# Altium schematic sheet Fri3D_2018_CONTROLLER_00.SchDoc: Fri3D Badge 2018
size A3; Date: 22/05/2017; DrawnBy: Wim Van Gool; DocumentNumber: 2; Revision: 00; SheetNumber: 2; SheetTotal: 4
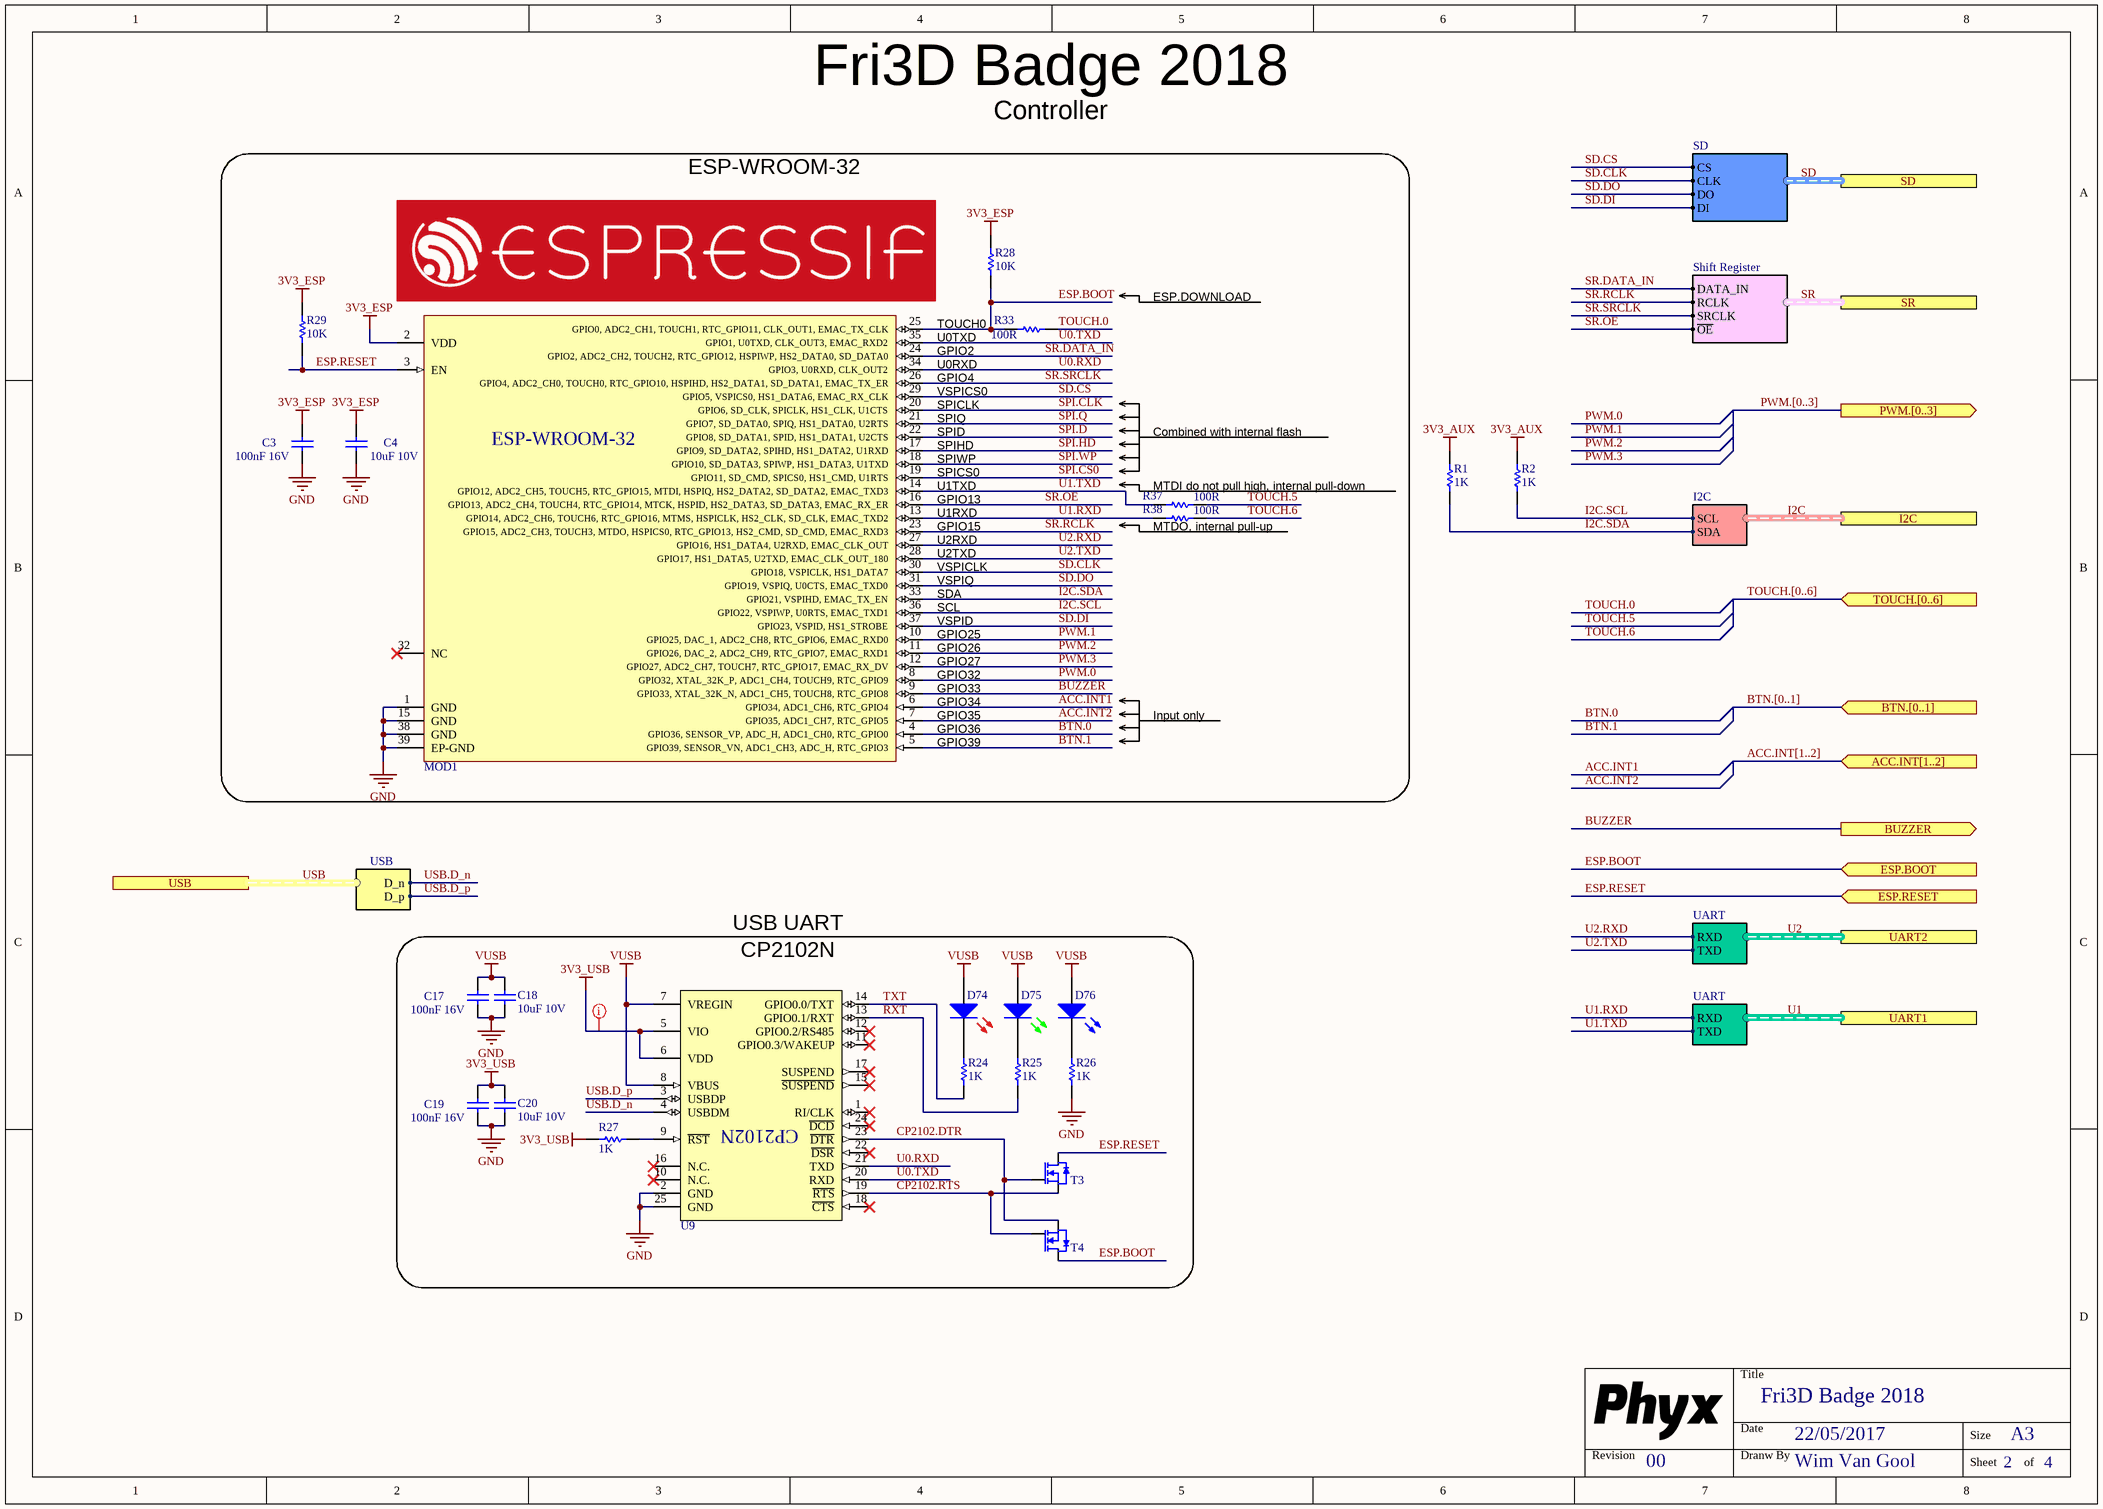
[diagram p0: Fri3D_2018_CONTROLLER_00.SchDoc]

## Parts
C3  value 100nF 16V  [C0603_N]
C4  value 10uF 10V  [C0805_N]  (hidden comment: CAP_CERAMIC)
C17  value 100nF 16V  [C0603_N]
C18  value 10uF 10V  [C0805_N]  (hidden comment: CAP_CERAMIC)
C19  value 100nF 16V  [C0603_N]
C20  value 10uF 10V  [C0805_N]  (hidden comment: CAP_CERAMIC)
D74  Default 0805 Red LED  [LED_0805_RD]  (value not drawn)
D75  Default 0805 Green LED  [LED_0805_GR]  (value not drawn)
D76  Default 0805 Blue LED  [LED_0805_BL]  (value not drawn)
MOD1  ESP-32 based ESP-WROOM-32  [ESP-WROOM-32]  (value not drawn)
R1  value 1K  [R0603_N]
R2  value 1K  [R0603_N]
R24  value 1K  [R0603_N]
R25  value 1K  [R0603_N]
R26  value 1K  [R0603_N]
R27  value 1K  [R0603_N]
R28  value 10K  [R0603_N]  (hidden comment: RESISTOR)
R29  value 10K  [R0603_N]  (hidden comment: RESISTOR)
R33  value 100R  [R0603_N]  (hidden comment: RESISTOR)
R37  value 100R  [R0603_N]  (hidden comment: RESISTOR)
R38  value 100R  [R0603_N]  (hidden comment: RESISTOR)
T3  0.2A N-Ch MOSFET Vgs 3.2  [SOT23-3]  (value not drawn)
T4  0.2A N-Ch MOSFET Vgs 3.2  [SOT23-3]  (value not drawn)
U9  USB to UART 3.3-5V  [QFN_24]  (value not drawn)

## Blocks framed on the sheet
ESP-WROOM-32: C3 C4 MOD1 R28 R29 R33 R37 R38

## Ports
ACC.INT[1..2] (in), BTN.[0..1] (in), BUZZER (out), ESP.BOOT (in), ESP.RESET (in), I2C (harness I2C), PWM.[0..3] (out), SD (harness SD), SR (harness Shift Register), TOUCH.[0..6] (in), UART1 (harness UART), UART2 (harness UART), USB (harness USB)

## Harnesses
Shift Register: DATA_IN, RCLK, SRCLK, ~{OE}
USB: D_p, D_n
I2C: SDA, SCL
SD: CS, CLK, DO, DI
UART: TXD, RXD

## Nets
3V3_AUX: R1.1 R2.1
3V3_ESP: C3.1 C4.1 MOD1.2(VDD) R28.1 R29.1
3V3_USB: C19.1 C20.2 R27.1 U9.5(VIO) U9.6(VDD)
GND: C3.2 C4.2 C17.2 C18.1 C19.2 C20.1 MOD1.1(GND) MOD1.15(GND) MOD1.38(GND) MOD1.39(EP-GND) R26.2 U9.2(GND) U9.25(GND)
VUSB: C17.1 C18.2 D74.1(A) D75.1(A) D76.1(A) U9.7(VREGIN) U9.8(VBUS)
ACC.INT1: MOD1.6(GPIO34,_ADC1_CH6,_RTC_GPIO4)
ACC.INT2: MOD1.7(GPIO35,_ADC1_CH7,_RTC_GPIO5)
BTN.0: MOD1.4(GPIO36,_SENSOR_VP,_ADC_H,_ADC1_CH0,_RTC_GPIO0)
BTN.1: MOD1.5(GPIO39,_SENSOR_VN,_ADC1_CH3,_ADC_H,_RTC_GPIO3)
BUZZER: MOD1.9(GPIO33,_XTAL_32K_N,_ADC1_CH5,_TOUCH8,_RTC_GPIO8) ; port BUZZER
CP2102.DTR: T3.1(G) T4.2(S) U9.23(~{DTR})
CP2102.RTS: T3.2(S) T4.1(G) U9.19(~{RTS})
ESP.BOOT: MOD1.25(GPIO0,_ADC2_CH1,_TOUCH1,_RTC_GPIO11,_CLK_OUT1,_EMAC_TX_CLK) R28.2 R33.1 T4.3(D) ; port ESP.BOOT
ESP.RESET: MOD1.3(EN) R29.2 T3.3(D) ; port ESP.RESET
I2C.SCL: MOD1.36(GPIO22,_VSPIWP,_U0RTS,_EMAC_TXD1) R2.2 ; port I2C.SCL
I2C.SDA: MOD1.33(GPIO21,_VSPIHD,_EMAC_TX_EN) R1.2 ; port I2C.SDA
PWM.0: MOD1.8(GPIO32,_XTAL_32K_P,_ADC1_CH4,_TOUCH9,_RTC_GPIO9)
PWM.1: MOD1.10(GPIO25,_DAC_1,_ADC2_CH8,_RTC_GPIO6,_EMAC_RXD0)
PWM.2: MOD1.11(GPIO26,_DAC_2,_ADC2_CH9,_RTC_GPIO7,_EMAC_RXD1)
PWM.3: MOD1.12(GPIO27,_ADC2_CH7,_TOUCH7,_RTC_GPIO17,_EMAC_RX_DV)
RXT: R25.2 U9.13(GPIO0.1/RXT)
SD.CLK: MOD1.30(GPIO18,_VSPICLK,_HS1_DATA7) ; port SD.CLK
SD.CS: MOD1.29(GPIO5,_VSPICS0,_HS1_DATA6,_EMAC_RX_CLK) ; port SD.CS
SD.DI: MOD1.37(GPIO23,_VSPID,_HS1_STROBE) ; port SD.DI
SD.DO: MOD1.31(GPIO19,_VSPIQ,_U0CTS,_EMAC_TXD0) ; port SD.DO
SPI.CLK: MOD1.20(GPIO6,_SD_CLK,_SPICLK,_HS1_CLK,_U1CTS)
SPI.CS0: MOD1.19(GPIO11,_SD_CMD,_SPICS0,_HS1_CMD,_U1RTS)
SPI.D: MOD1.22(GPIO8,_SD_DATA1,_SPID,_HS1_DATA1,_U2CTS)
SPI.HD: MOD1.17(GPIO9,_SD_DATA2,_SPIHD,_HS1_DATA2,_U1RXD)
SPI.Q: MOD1.21(GPIO7,_SD_DATA0,_SPIQ,_HS1_DATA0,_U2RTS)
SPI.WP: MOD1.18(GPIO10,_SD_DATA3,_SPIWP,_HS1_DATA3,_U1TXD)
SR.DATA_IN: MOD1.24(GPIO2,_ADC2_CH2,_TOUCH2,_RTC_GPIO12,_HSPIWP,_HS2_DATA0,_SD_DATA0) ; port SR.DATA_IN
SR.~{OE}: MOD1.16(GPIO13,_ADC2_CH4,_TOUCH4,_RTC_GPIO14,_MTCK,_HSPID,_HS2_DATA3,_SD_DATA3,_EMAC_RX_ER) ; port SR.~{OE}
SR.RCLK: MOD1.23(GPIO15,_ADC2_CH3,_TOUCH3,_MTDO,_HSPICS0,_RTC_GPIO13,_HS2_CMD,_SD_CMD,_EMAC_RXD3) ; port SR.RCLK
SR.SRCLK: MOD1.26(GPIO4,_ADC2_CH0,_TOUCH0,_RTC_GPIO10,_HSPIHD,_HS2_DATA1,_SD_DATA1,_EMAC_TX_ER) ; port SR.SRCLK
TOUCH.0: R33.2
TOUCH.5: R37.2
TOUCH.6: R38.2
TXT: R24.2 U9.14(GPIO0.0/TXT)
U0.RXD: MOD1.34(GPIO3,_U0RXD,_CLK_OUT2) U9.21(TXD)
U0.TXD: MOD1.35(GPIO1,_U0TXD,_CLK_OUT3,_EMAC_RXD2) U9.20(RXD)
U1.RXD: MOD1.13(GPIO14,_ADC2_CH6,_TOUCH6,_RTC_GPIO16,_MTMS,_HSPICLK,_HS2_CLK,_SD_CLK,_EMAC_TXD2) R38.1 ; port UART1.RXD
U1.TXD: MOD1.14(GPIO12,_ADC2_CH5,_TOUCH5,_RTC_GPIO15,_MTDI,_HSPIQ,_HS2_DATA2,_SD_DATA2,_EMAC_TXD3) R37.1 ; port UART1.TXD
U2.RXD: MOD1.27(GPIO16,_HS1_DATA4,_U2RXD,_EMAC_CLK_OUT) ; port UART2.RXD
U2.TXD: MOD1.28(GPIO17,_HS1_DATA5,_U2TXD,_EMAC_CLK_OUT_180) ; port UART2.TXD
USB.D_n: U9.4(USBDM) ; port USB.D_n
USB.D_p: U9.3(USBDP) ; port USB.D_p
NetD74_2: D74.2(K) R24.1
NetD75_2: D75.2(K) R25.1
NetD76_2: D76.2(K) R26.1
NetR27_2: R27.2 U9.9(~{RST})

Not connected (* = marked no-connect by the designer): MOD1 32(NC)*; U9 1(RI/CLK)* 10(N.C.)* 11(GPIO0.3/WAKEUP)* 12(GPIO0.2/RS485)* 15(~{SUSPEND})* 16(N.C.)* 17(SUSPEND)* 18(~{CTS})* 22(~{DSR})* 24(~{DCD})*

## Buses and harness runs
bus ACC.INT[1..2] = port ACC.INT[1..2]
bus BTN.[0..1] = port BTN.[0..1]
bus PWM.[0..3] = port PWM.[0..3]
bus TOUCH.[0..6] = port TOUCH.[0..6]
harness I2C = port I2C
harness SD = port SD
harness SR = port SR
harness U1 = port UART1
harness U2 = port UART2
harness USB = port USB

## Layout directives
net class POWER: 3V3_USB

## Notes on the sheet
- Fri3D Badge 2018
- Controller
- TOUCH0
- ESP.DOWNLOAD
- (near MOD1) VSPICS0
- U0TXD
- U0RXD
- GPIO2
- (near MOD1) GPIO4
- (near MOD1) SPICLK
- (near MOD1) SPIQ
- (near MOD1) SPID
- (near MOD1) SPIHD
- (near MOD1) SPIWP
- Combined with internal flash
- (near MOD1) SPICS0
- (near MOD1) U1TXD
- (near MOD1) U1RXD
- (near MOD1) GPIO15
- (near MOD1) GPIO13
- (near R37) MTDI do not pull high, internal pull-down
- (near R38) MTDO, internal pull-up
- (near MOD1) SDA
- (near MOD1) VSPICLK
- (near MOD1) VSPIQ
- (near MOD1) U2TXD
- (near MOD1) U2RXD
- (near MOD1) SCL
- (near MOD1) VSPID
- (near MOD1) GPIO25
- (near MOD1) GPIO26
- (near MOD1) GPIO27
- (near MOD1) GPIO32
- (near MOD1) GPIO33
- (near MOD1) GPIO34
- (near MOD1) GPIO35
- (near MOD1) GPIO36
- Input only
- (near MOD1) GPIO39
- USB UART
- (near U9) CP2102N
- Title
- Revision
- Date
- Dranw By
- Size
- A3
- Sheet
- of
- (in symbol CP2102N # QFN24 USB UART) CP2102N

## Library data of the parts
C3 C17 C19 = CAP # 100nF 16V 0603: Capacitor Ceramic
C4 C18 C20 = CAP # 10uF 10V 0805: Capacitor Ceramic; Supplier 1: Farnell; Supplier Part Number 1: 2320859
D74 = LED # Red 0805: =Description; Supplier 1: Farnell; Supplier Part Number 1: 2099236
D75 = LED # Green 0805: =Description; Supplier 1: Farnell; Supplier Part Number 1: 2099239
D76 = LED # Blue 0805: =Description; Supplier 1: Farnell; Supplier Part Number 1: 2217980
MOD1 = WiFi # MOD ESP-WROOM-32: Value: ESP-WROOM-32; Supplier 1: Espressif; Supplier Part Number 1: ESP-WROOM-32
R1 R2 R24-R27 = RES # 1K 0603
R28 R29 = RES # 10K 0603: Supplier 1: Farnell; Supplier Part Number 1: 2502397
R33 R37 R38 = RES # 100R 0603
T3 T4 = BSS138 N-Ch MOSFET 0.2A 3.2Vgs 60Vds: Value: BSS138; Supplier 1: Farnell; Supplier Part Number 1: 2432717
U9 = CP2102N # QFN24 USB UART: =Description; Value: CP2102N-A01-GQFN24; Supplier 1: Farnell; Supplier Part Number 1: 2577278; Supplier 2: Digikey; Supplier Part Number 2: 336-3693-ND